# EAGLE schematic PSU_SCHEMATIC (EAGLE 7.2.0)
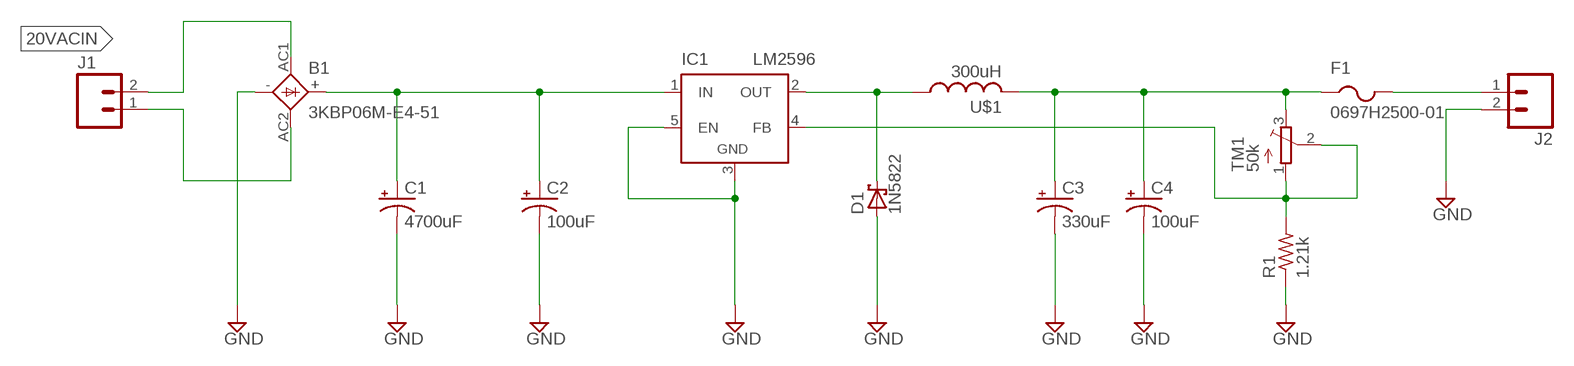
[diagram p0: schematic, sheet 1]

## Parts
B1  3KBP06M-E4-51  2KBP  [2KBP]
C1  4700uF  CAP_POLPTH2  [CPOL-RADIAL-10UF-25V]
C2  100uF  CAP_POLPTH2  [CPOL-RADIAL-10UF-25V]
C3  330uF  CAP_POLPTH2  [CPOL-RADIAL-10UF-25V]
C4  100uF  CAP_POLPTH2  [CPOL-RADIAL-10UF-25V]
D1  1N5822  SCHOTTKY-DIODEDO201T15  [DO201T15]
F1  0697H2500-01  PTCFUSE-1206  [R1206]
IC1  LM2596  LM2596TV  [TO220-51]
J1  M025MM  [SCREWTERMINAL-5MM-2]
J2  M025MM  [SCREWTERMINAL-5MM-2]
R1  1.21k  R-US_M0805  [M0805]
TM1  50k  TRIMPOTTC33X  [TC33X]
U$1  300uH  L  [6000]

## Nets
20VACIN: B1.AC1 J1.2
GND: B1.- C1.2(-) C2.2(-) C3.2(-) C4.2(-) D1.A IC1.3(GND) IC1.5(EN) J2.2 R1.1
N$2: B1.AC2 J1.1
N$3: B1.+ C1.1(+) C2.1(+) IC1.1(IN)
N$4: IC1.4(FB) R1.2 TM1.1(A) TM1.2(S)
N$5: D1.C IC1.2(OUT) U$1.1
N$6: C3.1(+) C4.1(+) F1.1 TM1.3(E) U$1.2
N$8: F1.2 J2.1

## Library data of the parts
B1 = rectifier:2KBP: RECTIFIER grid 3 x 3,81 mm
C1-C4 = SparkFun-Passives:CAP_POL: Capacitor Polarized These are standard SMD and PTH capacitors. Normally 10uF, 47uF, and 100uF in electrolytic and tantalum varieties. Always verify the external diameter of the through hole cap, it varies with capacity, voltage, and manufacturer. The EIA devices should be standard.
D1 = adafruit:SCHOTTKY-DIODE: Schottky Diode
F1 = adafruit:PTCFUSE: PTC fuses, resettable thermistors
IC1 = linear:LM2596T: STEP-DOWN VOLTAGE REGULATOR
J1 J2 = SparkFun-Connectors:M02: Standard 2-pin 0.1" header. Use with - straight break away headers ( PRT-00116) - right angle break away headers (PRT-00553) - swiss pins (PRT-00743) - machine pins (PRT-00117) - female headers (PRT-00115) Molex polarized connector foot print use with: PRT-08233 with associated crimp pins and housings. 2.54_SCREWTERM for use with PRT-10571. 3.5mm Screw Terminal footprints for PRT-08084 5mm Screw Terminal footprints for use with PRT-08432; STOREFRONT_ID: PRT-08432
R1 = adafruit:R-US_: RESISTOR, American symbol
TM1 = adafruit:TRIMPOT: SMT trimmer potentiometer part number TC33X http://www.ladyada.net/library/eagle
U$1 = adafruit:L